# Altium schematic sheet 原理图.SCHDOC: LED智能调光灯
size A4
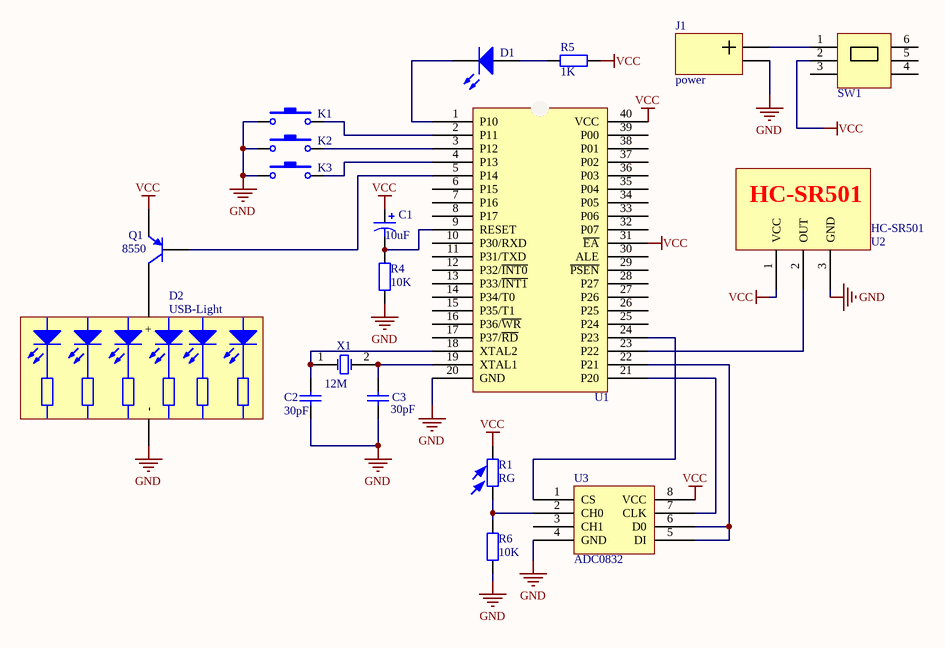
[diagram p0: 原理图.SCHDOC]

## Parts
C1  10uF  [CAP_2]
C2  30pF  [CAP]
C3  30pF  [CAP]
D1  (no value)  [LED]
D2  USB-Light  [USB-A - 2]
J1  power  [DC3.5]
K1  KEY  [KEY]  (value not drawn)
K2  KEY  [KEY]  (value not drawn)
K3  KEY  [KEY]  (value not drawn)
Q1  8550  [NPN]
R1  RG
R4  10K  [RES]
R5  1K  [RES]
R6  10K  [RES]
SW1  SWT  [SWT]  (value not drawn)
U1  STC89C52  [DIP40]  (value not drawn)
U2  HC-SR501  [HC-SR501]
U3  ADC0832  [DIP8]
X1  12M  [XTAL]

## Nets
GND: C2.1 C3.1 D2.2(-) J1.2 K1.1 K2.1 K3.1 R4.1 R6.1 U1.20(GND) U2.3(GND) U3.4(GND)
VCC: C1.1 Q1.E R1.2 R5.2 SW1.2 U1.31(~{EA}) U1.40(VCC) U2.1(VCC) U3.8(VCC)
NetC1_2: C1.2 R4.2 U1.9(RESET)
NetC2_2: C2.2 U1.18(XTAL2) X1.1(OSC1)
NetC3_2: C3.2 U1.19(XTAL1) X1.2(OSC2)
NetD1_1: D1.1 R5.1
NetD1_2: D1.2 U1.1(P10)
NetD2_1: D2.1(+) Q1.C
NetJ1_1: J1.1 SW1.1
NetK1_2: K1.2 U1.2(P11)
NetK2_2: K2.2 U1.3(P12)
NetK3_2: K3.2 U1.4(P13)
NetQ1_B: Q1.B U1.5(P14)
NetR1_1: R1.1 R6.2 U3.2(CH0)
NetU1_21: U1.21(P20) U3.7(CLK)
NetU1_22: U1.22(P21) U3.5(DI) U3.6(D0)
NetU1_23: U1.23(P22) U2.2(OUT)
NetU1_24: U1.24(P23) U3.1(CS)

Not connected (* = marked no-connect by the designer): SW1 3(2) 4(3) 5(4) 6(5); U1 6(P15) 7(P16) 8(P17) 10(P30/RXD) 11(P31/TXD) 12(P32/~{INT0}) 13(P33/~{INT1}) 14(P34/T0) 15(P35/T1) 16(P36/~{WR}) 17(P37/~{RD}) 25(P24) 26(P25) 27(P26) 28(P27) 29(~{PSEN}) 30(ALE) 32(P07) 33(P06) 34(P05) 35(P04) 36(P03) 37(P02) 38(P01) 39(P00); U3 3(CH1)

## Library data of the parts
C1 = CAP_2
C2 C3 = CAP
D1 = LED
J1 = DC5.5
Q1 = PNP
R4-R6 = Res
X1 = XTAL